# EAGLE design output amp w gp (EAGLE 6.5.0)
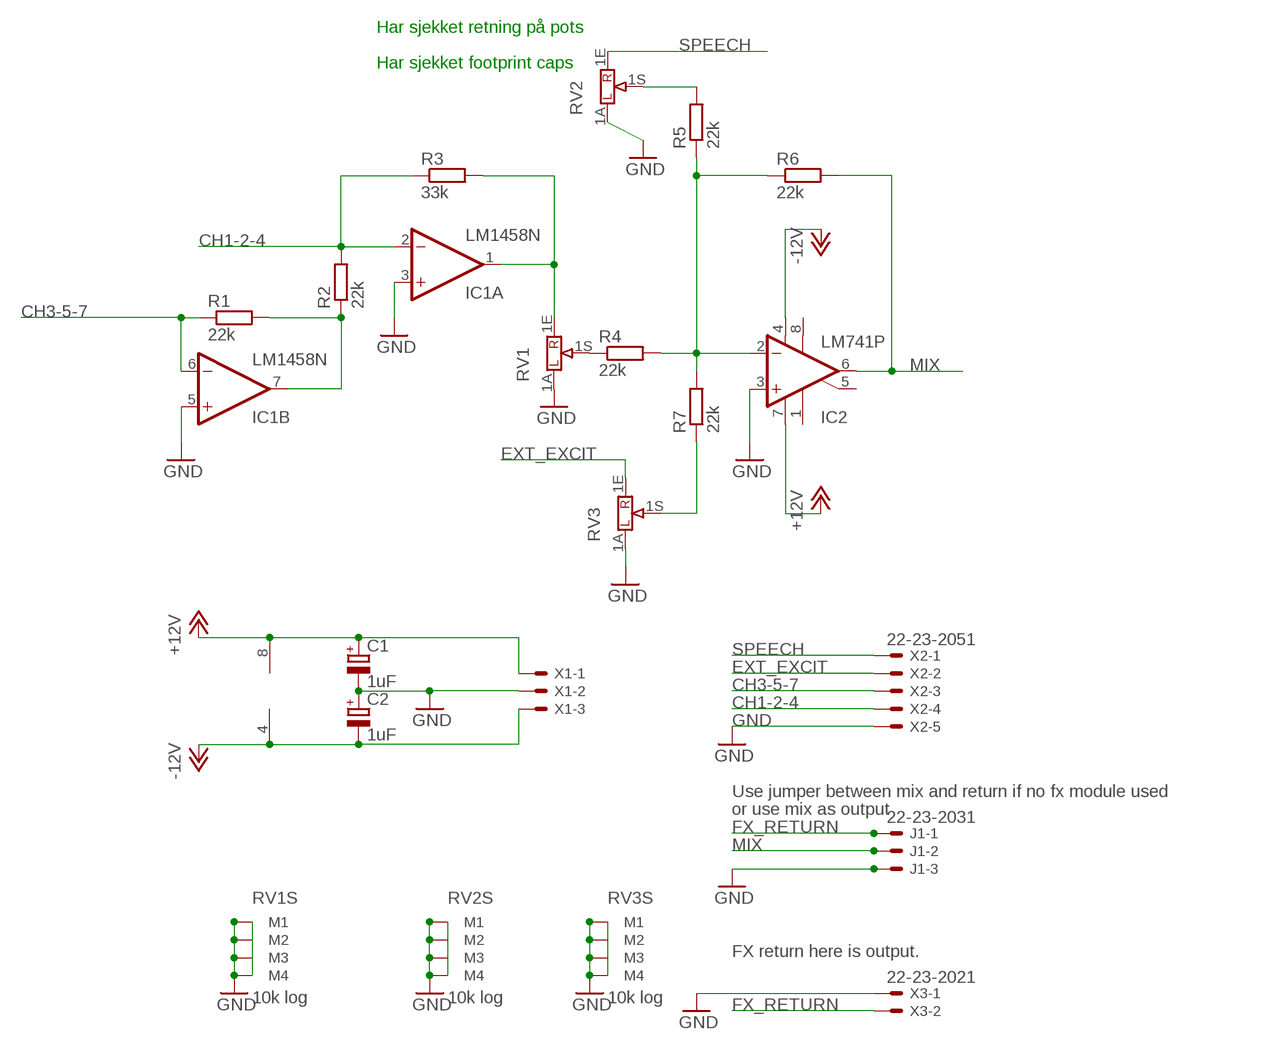
[diagram p0: schematic, sheet 1]

## Parts
C1  1uF  CPOL-EUE2.5-5  [E2,5-5]
C2  1uF  CPOL-EUE2.5-5  [E2,5-5]
IC1  LM1458N  [DIL08]
IC2  LM741P  [DIL08]
J1  22-23-2031  [22-23-2031]
R1  22k  R-EU_0207/7  [0207/7]
R2  22k  R-EU_0207/7  [0207/7]
R3  33k  R-EU_0207/7  [0207/7]
R4  22k  R-EU_0207/7  [0207/7]
R5  22k  R-EU_0207/7  [0207/7]
R6  22k  R-EU_0207/7  [0207/7]
R7  22k  R-EU_0207/7  [0207/7]
RV1  10k log  POT16_W_BRACKET""  [POT16_W_BRACKET]
RV2  10k log  POT16_W_BRACKET""  [POT16_W_BRACKET]
RV3  10k log  POT16_W_BRACKET""  [POT16_W_BRACKET]
X1  KK-156-3  [KK-156-3]
X2  22-23-2051  [22-23-2051]
X3  22-23-2021  [22-23-2021]

## Nets
+12V: C1.+ IC1.8(P:V+) IC2.7(V+) X1.1
-12V: C2.- IC1.4(P:V-) IC2.4(V-) X1.3
CH1-2-4: IC1.2(A:-IN) R2.2 R3.1 X2.4
CH3-5-7: IC1.6(B:-IN) R1.1 X2.3
EXT_EXCIT: RV3.1E X2.2
FX_RETURN: J1.1 X3.2
GND: C1.- C2.+ IC1.3(A:+IN) IC1.5(B:+IN) IC2.3(+IN) J1.3 RV1.1A RV1.M1 RV1.M2 RV1.M3 RV1.M4 RV2.1A RV2.M1 RV2.M2 RV2.M3 RV2.M4 RV3.1A RV3.M1 RV3.M2 RV3.M3 RV3.M4 X1.2 X2.5 X3.1
MIX: IC2.6(OUT) J1.2 R6.2
N$1: R4.1 RV1.1S
N$3: IC1.7(B:OUT) R1.2 R2.1
N$6: IC1.1(A:OUT) R3.2 RV1.1E
N$7: R7.1 RV3.1S
N$8: IC2.2(-IN) R4.2 R5.1 R6.1 R7.2
N$10: R5.2 RV2.1S
SPEECH: RV2.1E X2.1
Unconnected: IC2.1(ON1) IC2.5(ON2) IC2.8(OPT)

## Notes on the sheet
- Har sjekket retning på pots
- Har sjekket footprint caps
- Use jumper between mix and return if no fx module used
- or use mix as output
- FX return here is output.

## Library data of the parts
C1 C2 = resistor:CPOL-EU: POLARIZED CAPACITOR, European symbol
IC1 = linear:*1458: OP AMP
IC2 = linear:*741: OP AMP
J1 = con-molex:22-23-2031: .100" (2.54mm) Center Header - 3 Pin; MF: MOLEX; MPN: 22-23-2031; OC_FARNELL: 1462950; OC_NEWARK: 30C0862
R1-R7 = resistor:R-EU_: RESISTOR, European symbol
RV1-RV3 = joakim:POT16_W_BRACKET: POTENTIOMETER potentiometer, 16 mm w 5mm pitch and OMEG bracket, 17,8 x 7,5 mm
X1 = con-molex:KK-156-3: KK 156 HEADER Source: http://www.molex.com/pdm_docs/sd/026604100_sd.pdf; OC_FARNELL: unknown; OC_NEWARK: unknown
X2 = con-molex:22-23-2051: .100" (2.54mm) Center Header - 5 Pin; MF: MOLEX; MPN: 22-23-2051; OC_FARNELL: 1462952; OC_NEWARK: 38C9178
X3 = con-molex:22-23-2021: .100" (2.54mm) Center Header - 2 Pin; MF: MOLEX; MPN: 22-23-2021; OC_FARNELL: 1462926; OC_NEWARK: 25C3832

## Board
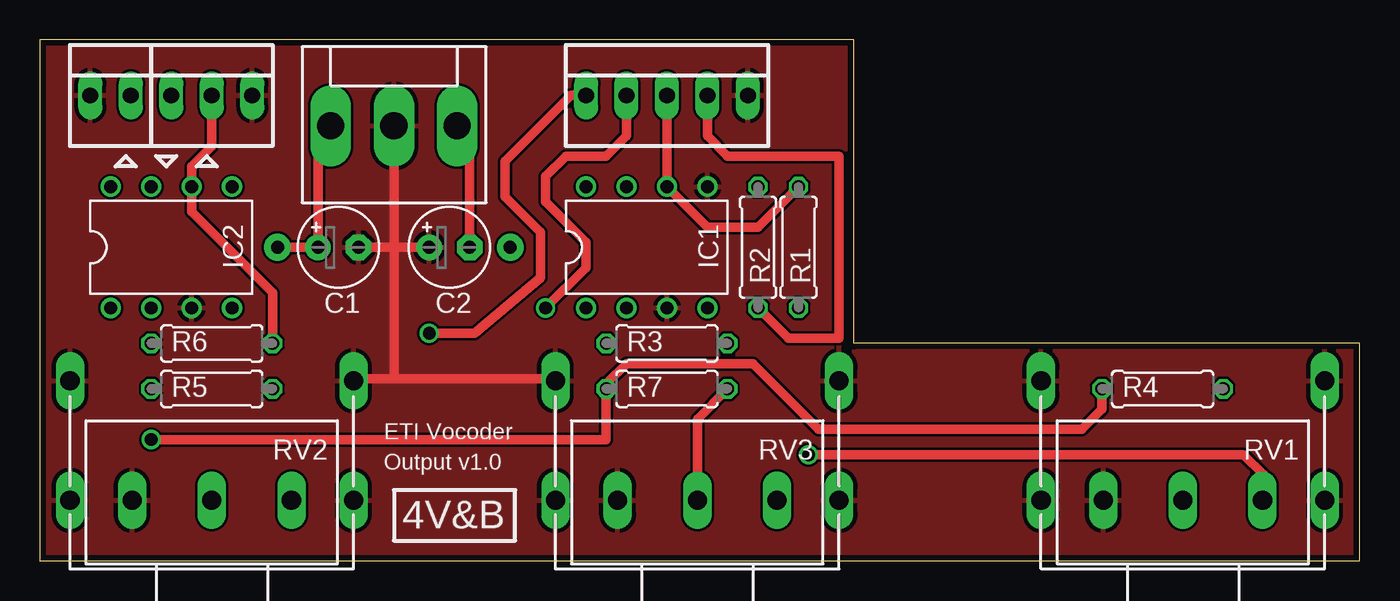
[diagram p1: board, top side]
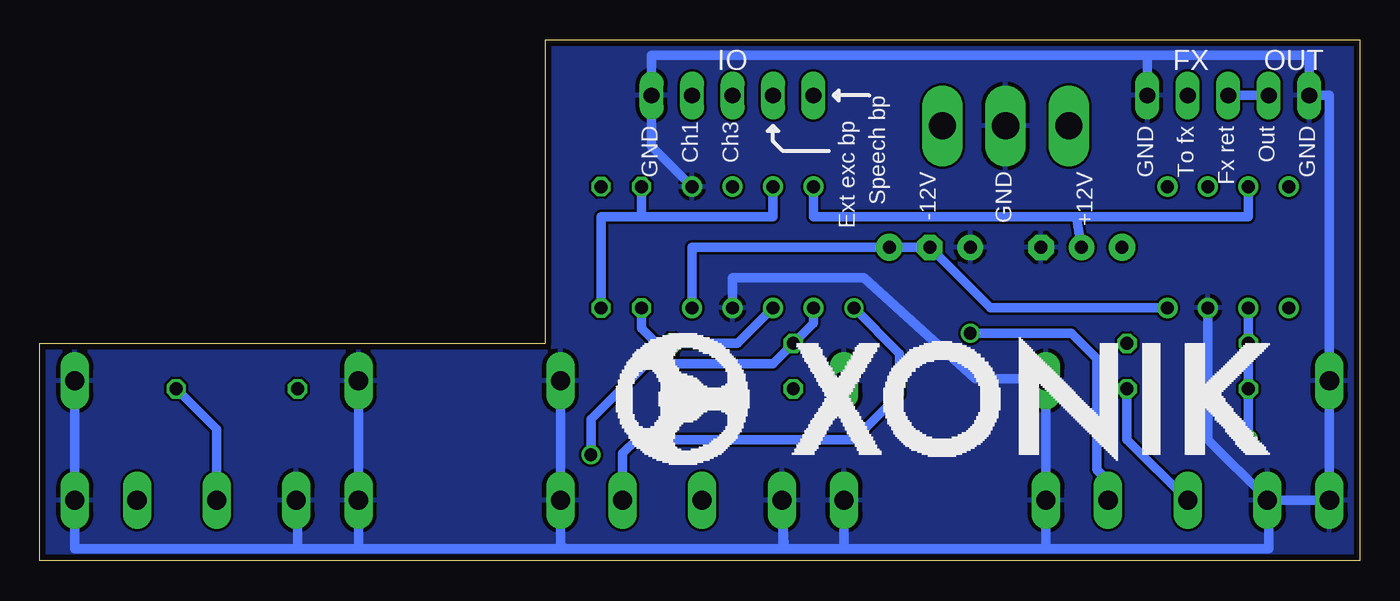
[diagram p2: board, bottom side, seen from below]

Size 82.86 x 32.7 mm. Coordinates in mm from the lower left corner, seen from the top.
Outline: 51.12,13.65 82.86,13.65 82.86,0 0,0 0,32.7 51.12,32.7 51.12,13.65
Outline: 51.11,13.65 51.12,13.65
Copper layers (1*16): Top 0.0356mm / dielectric 1.5011mm / Bottom 0.0356mm
Design rules "oshpark-2layer": minimum track width 6mil, minimum drill 13mil, track to track 6mil, track to pad 6mil, pad to pad 6mil, via to via 6mil, smd to smd 6mil, copper to edge 15mil, drill to drill 6mil, minimum pad ring 7mil, minimum via ring 7mil, stop-mask expansion 2.5mil, vias tented up to drill 0mil, thermal gap 10mil

### Footprints (pad centres in the part's own frame; a part is rotated, then mirrored left to right if it is on the bottom)
E2,5-5 = drill 0.813 pad 1.6: + -1.27,0 | drill 0.813 pad 1.6 octagon: - 1.27,0
DIL08 = drill 0.813 pad 1.27: 1 -3.81,-3.81; 2 -1.27,-3.81; 3 1.27,-3.81; 4 3.81,-3.81; 5 3.81,3.81; 6 1.27,3.81; 7 -1.27,3.81; 8 -3.81,3.81
22-23-2031 = drill 1 long: 1 -2.54,0; 2 0,0; 3 2.54,0
0207/7 = drill 0.813 octagon: 1 -3.81,0; 2 3.81,0
POT16_W_BRACKET = drill 1.2 long: 1A -5,0; 1E 5,0; 1S 0,0; M1 -8.9,0; M2 8.9,0; M3 8.9,7.5; M4 -8.9,7.5
KK-156-3 = drill 1.7 pad 2.184 long: 1 -3.96,0; 2 0,0; 3 3.96,0
22-23-2051 = drill 1 long: 1 -5.08,0; 2 -2.54,0; 3 0,0; 4 2.54,0; 5 5.08,0
22-23-2021 = drill 1 long: 1 -1.27,0; 2 1.27,0

### Placement (x,y rotation side)
C1  18.73,19.68 0 top
C2  25.72,19.68 0 top
IC1  38.1,19.68 0 top
IC2  8.26,19.68 0 top
J1  10.79,29.21 0 top
R1  47.62,19.68 270 top
R2  45.09,19.68 270 top
R3  39.37,13.65 180 top
R4  70.48,10.79 180 top
R5  10.79,10.79 0 top
R6  10.79,13.65 0 top
R7  39.37,10.79 180 top
RV1  71.75,3.81 0 top
RV2  10.79,3.81 0 top
RV3  41.27,3.81 0 top
X1  22.23,27.3 0 top
X2  39.37,29.21 0 top
X3  4.45,29.21 0 top

### Tracks (layer width: path | path; a pad name or v marks a point on that pad's centre or on a via)
+12V  (via drill 0.8 pad 1.68)
  Top 0.61: X1.1 17.46,26.5 C1.+ v14.92,19.68
  Bottom 0.61: IC1.8 34.29,21.59 17.78,21.59 | IC2.7 6.99,21.59 17.78,21.59 | 17.78,21.59 C1.+
-12V  (via drill 0.8 pad 1.68)
  Top 0.61: C2.- 26.99,26.52 X1.3
  Bottom 0.61: IC2.4 23.18,15.88 C2.- v29.53,19.68 41.91,19.68 IC1.4
CH1-2-4
  Top 0.61: X2.4 41.91,26.67 43.18,25.4 50.16,25.4 50.16,13.97 46.99,13.97 R2.2
  Bottom 0.61: IC1.2 39.05,13.65 R3.1 44.13,13.65 45.09,14.61 R2.2
CH3-5-7
  Top 0.61: R1.1 45.09,20.95 41.91,20.95 IC1.6 X2.3
EXT_EXCIT  (via drill 0.8)
  Top 0.61: v31.75,15.88 34.29,18.41 34.29,20 31.75,22.54 31.75,24.13 33.02,25.4 35.56,25.4 36.83,26.67 X2.2
  Bottom 0.61: RV3.1E 46.27,6.75 45.4,7.62 31.75,7.62 28.89,10.48 28.89,13.02 v31.75,15.88
FX_RETURN
  Bottom 0.61: X3.2 J1.1
GND
  Top 0.61: X1.2 22.23,19.68 | 22.23,19.68 C1.- | C2.+ 22.23,19.68 | 22.23,19.68 22.23,11.43 | 22.23,11.43 19.82,11.43 RV2.M3 | RV3.M4 32.38,11.42 32.38,11.43 22.23,11.43
  Bottom 0.305: 1.91,3.81 RV2.M1
  Bottom 0.61: RV2.1A 5.79,3.89 9.53,7.62 IC2.3 | 1.91,3.81 RV2.1A | RV2.M1 RV2.M4 1.91,11.32 1.91,29.21 X3.1 3.17,31.75 13.34,31.75 | 19.7,1.92 19.68,0.76 | 19.68,0.76 5.71,0.76 5.71,3.73 RV2.1A | 19.7,1.92 RV2.M2 RV2.M3 19.82,11.43 24.13,11.43 31.11,17.78 39.37,17.78 IC1.3 | 19.7,1.92 19.7,0.9 19.68,0.76 | 19.68,0.76 32.38,0.76 | 32.38,0.76 36.2,0.76 | 36.2,0.76 36.2,3.73 RV3.1A 36.15,0.97 36.2,0.76 | 36.2,0.76 49.85,0.76 | 49.85,0.76 50.16,0.76 | 50.16,0.76 62.87,0.76 | 62.87,0.76 66.67,0.76 | 66.67,0.76 66.67,3.73 RV1.1A | 66.67,0.76 80.64,0.76 80.66,0.77 RV1.M2 RV1.M3 | 13.34,31.75 44.45,31.75 X2.5 44.45,26.04 IC1.5 | RV3.M1 32.38,0.9 32.38,0.76 | 62.87,0.76 62.85,1.03 RV1.M1 RV1.M4 | J1.3 13.34,31.75 | RV3.M3 RV3.M2 | RV3.M2 50.17,0.96 49.85,0.76 | RV3.M2 50.17,0.77 50.16,0.76
  pour Bottom: -0.64,33.66 82.55,33.66 82.55,0.32 -0.64,0.32
  pour Top: 0,32.7 83.5,32.7 83.5,-0.32 0,-0.32
MIX
  Top 0.61: R6.2 14.61,16.83 9.53,21.91 IC2.6 9.53,24.77 10.79,26.04 J1.2
N$1
  Bottom 0.61: RV1.1S 71.75,8.26 R4.1
N$3
  Bottom 0.61: IC1.7 36.83,21.59 45.09,21.59 | 45.09,21.59 47.62,21.59 R1.2 | R2.1 45.09,21.59
N$6  (via drill 0.8)
  Top 0.61: v48.26,6.67 75.56,6.67 76.83,5.4 76.83,3.89 RV1.1E
  Bottom 0.61: IC1.1 34.29,14.92 R3.2 36.83,12.38 44.77,12.38 48.26,8.89 v48.26,6.67 | 76.83,3.89 RV1.1E
N$7
  Top 0.61: R7.1 41.27,8.89 RV3.1S
N$8  (via drill 0.8)
  Top 0.61: v6.99,7.62 35.56,7.62 R7.2 35.56,11.11 36.83,12.38 44.77,12.38 48.9,8.26 65.41,8.26 66.67,9.53 R4.2
  Bottom 0.61: v6.99,7.62 R5.1 R6.1 IC2.2
N$10
  Bottom 0.61: RV2.1S 14.61,7.62 R5.2
SPEECH  (via drill 0.8)
  Top 0.61: v24.45,14.29 27.3,14.29 31.43,17.78 31.43,20.64 29.21,22.86 29.21,25.08 33.34,29.21 X2.1
  Bottom 0.61: RV2.1E 15.79,5 16.51,5.71 16.51,12.7 18.1,14.29 v24.45,14.29

### Text on the board
tNames: ETI Vocoder | Output v1.0 | 4V&B
bNames: OUT | FX | IO | Speech bp | Ext exc bp | Ch3 | Ch1 | GND | Out | Fx ret | To fx | GND | GND | +12V | GND | -12V